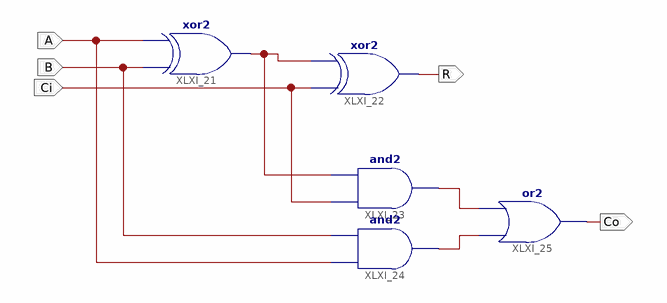
[diagram p0: schematic sheet 1]
// Xilinx ISE schematic Add1b.sch (spartan3e) as structural Verilog: 5 symbols, 5 ports
module Add1b (
  input  A,
  input  B,
  input  Ci,
  output R,
  output Co
);

  wire XLXN_35, XLXN_37, XLXN_38;

  xor XLXI_21 (XLXN_35, B, A);
  xor XLXI_22 (R, Ci, XLXN_35);
  and XLXI_23 (XLXN_37, Ci, XLXN_35);
  and XLXI_24 (XLXN_38, A, B);
  or XLXI_25 (Co, XLXN_38, XLXN_37);
endmodule
